# EAGLE schematic HIGH-IP3-PGA103 (EAGLE 7.2.0)
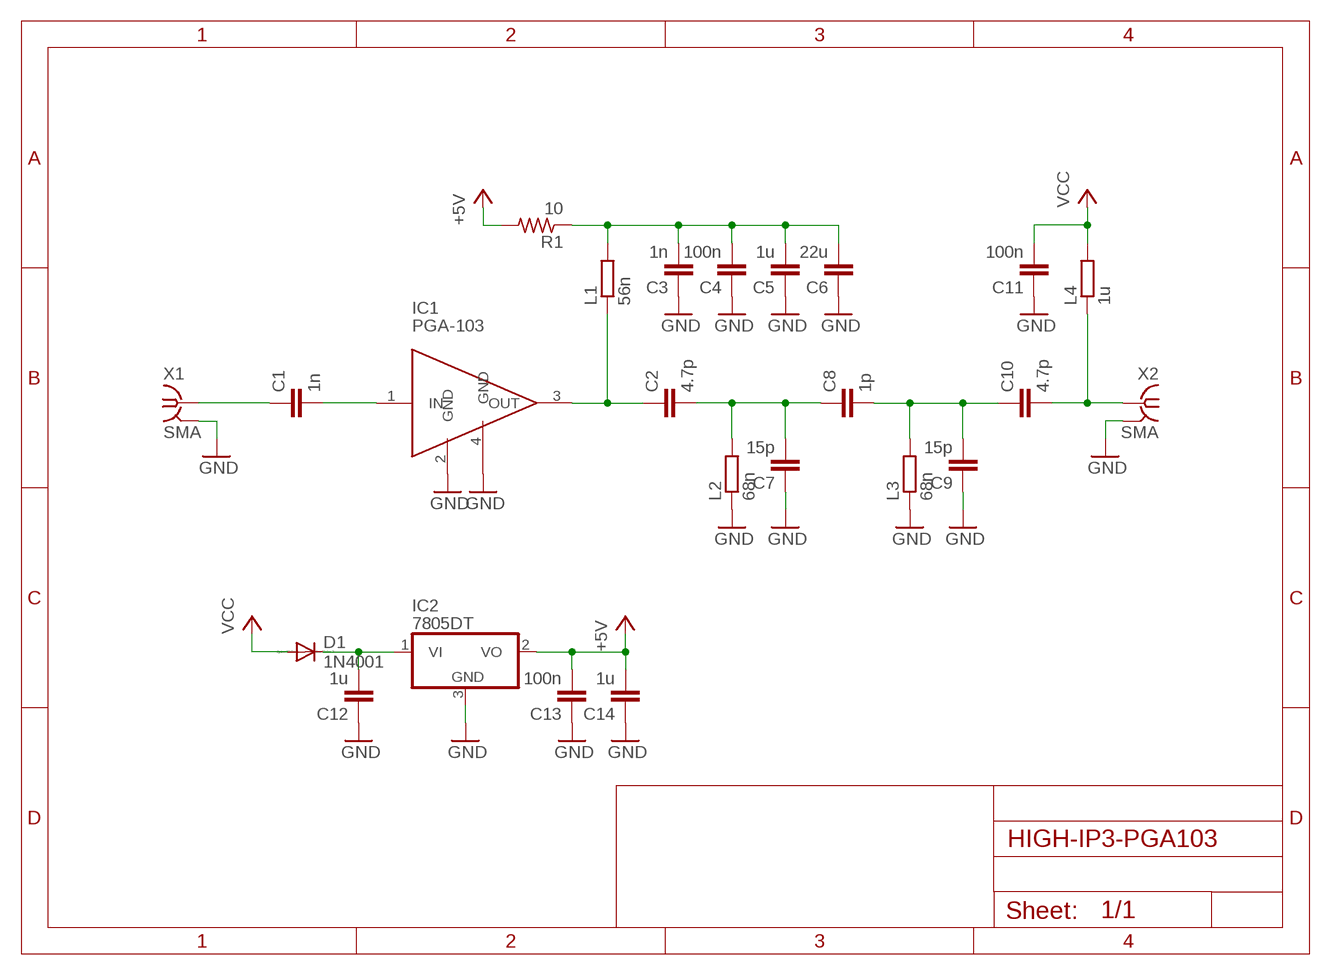
[diagram p0: schematic, sheet 1]

## Parts
C1  1n  C-EUC0805  [C0805]
C2  4.7p  C-EUC0805  [C0805]
C3  1n  C-EUC0805  [C0805]
C4  100n  C-EUC0805  [C0805]
C5  1u  C-EUC0805  [C0805]
C6  22u  C-EUC0805  [C0805]
C7  15p  C-EUC0805  [C0805]
C8  1p  C-EUC0805  [C0805]
C9  15p  C-EUC0805  [C0805]
C10  4.7p  C-EUC0805  [C0805]
C11  100n  C-EUC0805  [C0805]
C12  1u  C-EUC0805  [C0805]
C13  100n  C-EUC0805  [C0805]
C14  1u  C-EUC0805  [C0805]
D1  1N4001  1N4148DO35-7  [DO35-7]
IC1  PGA-103  [SOT89]
IC2  7805DT  [TO252]
L1  56n  R-EU_R0805  [R0805]
L2  68n  R-EU_R0805  [R0805]
L3  68n  R-EU_R0805  [R0805]
L4  1u  R-EU_R0805  [R0805]
R1  10  R-US_R0805  [R0805]
X1  SMA  SMA-142-0701-801/806  [J502-ND-142-0701-801/806]
X2  SMA  SMA-142-0701-801/806  [J502-ND-142-0701-801/806]

## Nets
+5V: C13.2 C14.2 IC2.2(VO) R1.2
GND: C3.1 C4.1 C5.1 C6.1 C7.1 C9.1 C11.1 C12.1 C13.1 C14.1 IC1.2(GND) IC1.4(GND) IC2.3(GND) L2.1 L3.1 X1.G@1 X1.G@2 X1.G@3 X1.G@4 X2.G@1 X2.G@2 X2.G@3 X2.G@4
N$1: C1.1 X1.1
N$2: C1.2 IC1.1(IN)
N$3: C2.1 IC1.3(OUT) L1.1
N$4: C8.2 C9.2 C10.1 L3.2
N$5: C2.2 C7.2 C8.1 L2.2
N$6: C3.2 C4.2 C5.2 C6.2 L1.2 R1.1
N$7: C10.2 L4.1 X2.1
N$8: C12.2 D1.C IC2.1(VI)
VCC: C11.2 D1.A L4.2

## Library data of the parts
C1-C14 = resistor:C-EU: CAPACITOR, European symbol
D1 = diode:1N4148: DIODE high speed (Philips)
IC1 = pga103:PGA-103
IC2 = linear:78*: Positive VOLTAGE REGULATOR Source: http://cache.national.com/ds/LM/LM78L05.pdf http://www.fairchildsemi.com/ds/LM/LM7805.pdf
L1-L4 = resistor:R-EU_: RESISTOR, European symbol
R1 = resistor:R-US_: RESISTOR, American symbol
X1 X2 = con-coax:SMA-: SMA 50 Ohm End Launch Jack Receptacle - Round Contact Johnson Components Source: www.johnsoncomponents.com .. J502-ND.pdf; MF: JOHNSON COMPONENTS; MPN: 142-0701-801; OC_FARNELL: 1608592; OC_NEWARK: 90F2624